# Altium schematic sheet Supply.SchDoc
size A4; SheetNumber: 2; SheetTotal: 8
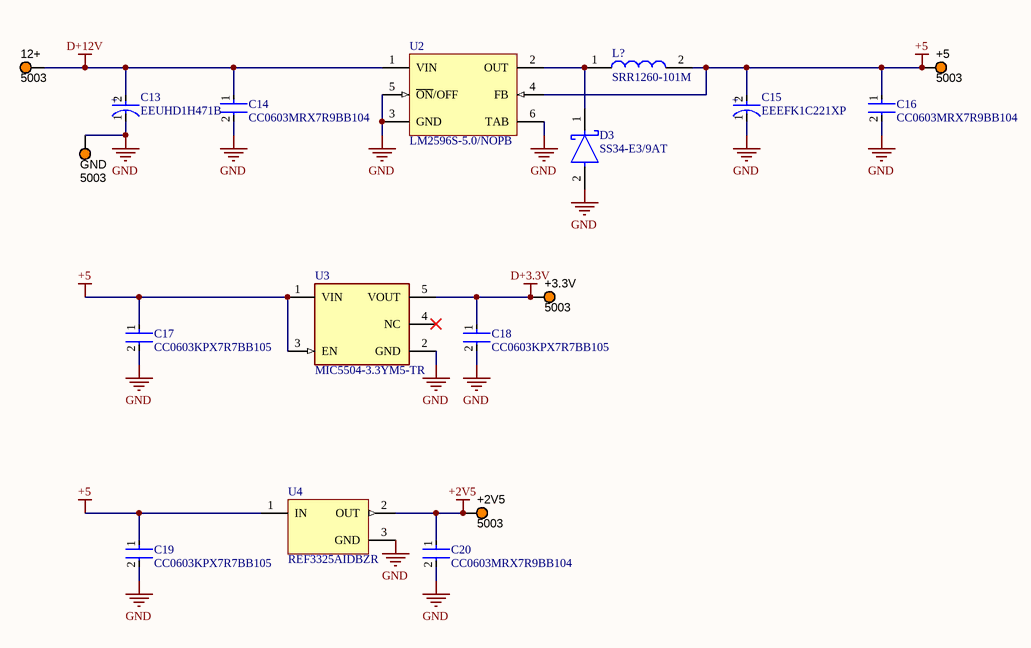
[diagram p0: Supply.SchDoc]

## Parts
12+  5003  [KSTN-5003]
+2V5  5003  [KSTN-5003]
+3.3V  5003  [KSTN-5003]
+5  5003  [KSTN-5003]
C13  EEUHD1H471B  [FP-RAD-TH-D_10_0_5-L_20_2-MFG]
C14  CC0603MRX7R9BB104  [FP-CC0603-DA-MFG]
C15  EEEFK1C221XP  [FP-FKD8-MFG]
C16  CC0603MRX7R9BB104  [FP-CC0603-DA-MFG]
C17  CC0603KPX7R7BB105  [FP-CC0603-DA-MFG]
C18  CC0603KPX7R7BB105  [FP-CC0603-DA-MFG]
C19  CC0603KPX7R7BB105  [FP-CC0603-DA-MFG]
C20  CC0603MRX7R9BB104  [FP-CC0603-DA-MFG]
D3  SS34-E3/9AT  [FP-SMC-MFG]
GND  5003  [KSTN-5003]
L?  SRR1260-101M  [SRR1260101M]
U2  LM2596S-5.0/NOPB  [KTT0005B_M]
U3  MIC5504-3.3YM5-TR  [FP-SOT23-5LD-PL-1-MFG]
U4  REF3325AIDBZR  [DBZ0003A_N]

## Nets
+2V5: +2V5.1 C20.1 U4.2(OUT)
+5: +5.1 C15.2(A) C16.1 C17.1 C19.1 L?.2 U2.4(FB) U3.1(VIN) U3.3(EN) U4.1(IN)
D+3.3V: +3.3V.1 C18.1 U3.5(VOUT)
D+12V: 12+.1 C13.2(A) C14.1 U2.1(VIN)
GND: C13.1(C) C14.2 C15.1(C) C16.2 C17.2 C18.2 C19.2 C20.2 D3.2(A) GND.1 U2.3(GND) U2.5(~{ON}/OFF) U2.6(TAB) U3.2(GND) U4.3(GND)
NetD3_1: D3.1(C) L?.1 U2.2(OUT)

Not connected (* = marked no-connect by the designer): U3 4(NC)*

## Notes on the sheet
- (in symbol CMP-05427-000071-1) +
- (in symbol CMP-05427-002121-1) +

## Library data of the parts
12+ +2V5 +3.3V +5 GND = CMP-002-00037-2: Test Point, Orange, Height 4.6 mm, Tail Length 3 mm, 1-Pin THD, RoHS; Manufacturer: Keystone; Colour: Orange; Packaging: Bulk; Package Description: 1-Pin Through Hole Device, Dia 2.54 mm; Pins: 1; Package Reference: 5003; Datasheet Version: Jun-15; Case/Package: 5003; Mounting Technology: TH; Connector Type: TestPoint; Diameter: 2.54mm; Contact Material: Bronze; Datasheet URL: http://keyelco.com/userAssets/file/M65p56.pdf; Manufacturer URL: http://www.keyelco.com/; Package Quantity: 10; Contact Plating: Tin; RoHS Compliant: True
C13 = CMP-05427-002121-1: Aluminum Electrolytic Capacitors (Radial Lead Type) AEC-Q200 Qualified 470uF ±20% 50V
C14 C16 C20 = CMP-03422-000537-1: CAP CER 0.1UF 50V X7R 0603; Manufacturer: YAGEO; Material: Ceramic; Capacitance: 100 nF; Temperature Coefficient: 15%; Tolerance: 0.2; Value: 100 nF; Temperature Range Low: -55°C; Height: 0.9mm; Temperature Range High: +125°C; Category: Cap; Package: CC0603-DA; Mouser Description: Cap Ceramic 50V 20% +Tol 20% -Tol X7R 15% TC 0.1uF SMD 0603; Temperature Characteristic: X7R; Footprint Url: http://www.yageo.com/exep/pages/download/literatures/UPY-C_GEN_24.pdf; Octopart: https://octopart.com/cc0603mrx7r9bb104-yageo-67308423; RoHS: TRUE; Voltage: 50 V; Manufacturer Part Number: CC0603MRX7R9BB104; Lead Free: Yes; ComponentLink2URL: http://www.yageo.com/documents/recent/UPY-GPHC_X7R_6.3V-to-50V_18.pdf; ComponentLink2Description: Datasheet; Digikey Description: CAP CER 0.1UF 50V X7R 0603; Device Class L2: Capacitors; Automotive: No; Voltage Rating: 50 V; Temperature: -55°C to +125°C; Device Class L1: Passive Components; Device Class L3: Ceramic Capacitors
C15 = CMP-05427-000071-1: CAP ALUM 220UF 20% 16V SMD; Life (Hours): 2000Hour; Ripple Current (AC): 280mA; Leakage Current: 3uA; Polarity: Polar; Material: Aluminium; Impedance: 340mR; Voltage Rating: 16V; Length: 7.7mm; Voltage: 16V; Termination: SMD/SMT; Voltage Rating (DC): 16V; Radiation Hardening: No; Number of Pins: 8; Construction: Cylindrical; Min Operating Temperature: -55°C; Mount: Surface Mount; Series: FK; Height: 7.7mm; REACH SVHC: No SVHC; Tolerance: 20%; Ripple Current: 280mA; Diameter: 6.3mm; RoHS Compliant: Yes; Case/Package: Radial; Height - Seated (Max): 0.315inch; Package Quantity: 900; Packaging: Tape and Reel; Max Operating Temperature: 105°C; Lead Free: Lead Free; Contact Plating: Tin; Width: 8.3mm; Capacitance: 220uF; ESR (Equivalent Series Resistance): 340mR
C17-C19 = CMP-03422-001047-1: CC0603 1 uF X7R 10.00% 16 V; Manufacturer: YAGEO; Temperature Coefficient: 15%; Tolerance: 0.1; Voltage Rating: 16 V; Capacitance: 1 uF; Material: Ceramic; Value: 1 uF; Device Class L3: Ceramic Capacitors; Temperature Characteristic: X7R; Device Class L2: Capacitors; Temperature Range Low: -55°C; Footprint Url: http://www.yageo.com/exep/pages/download/literatures/UPY-C_GEN_24.pdf; Device Class L1: Passive Components; Temperature: -55°C to +125°C; RoHS: TRUE; ComponentLink2URL: http://www.yageo.com/documents/recent/UPY-GPHC_X7R_6.3V-to-50V_18.pdf; Mouser Description: Cap Ceramic 1uF 16V X7R 10% SMD 0603 125°C Paper T/R; Octopart: https://octopart.com/cc0603kpx7r7bb105-yageo-25629533; Automotive: No; Height: 0.9mm; Voltage: 16 V; Lead Free: Yes; Category: Cap; Package: CC0603-DA; Temperature Range High: +125°C; Manufacturer Part Number: CC0603KPX7R7BB105; ComponentLink2Description: Datasheet
D3 = CMP-02539-000066-1: DIODE SCHOTTKY 40V 3A DO214AB; Peak Non-Repetitive Surge Current: 100A; Forward Voltage: 500mV; Element Configuration: Single; Max Reverse Current: 500uA; Case/Package: SMC; Radiation Hardening: No; Series: -; Max Surge Current: 100A; RoHS Compliant: Yes; Min Operating Temperature: -55°C; Average Rectified Current: 3A; Max Reverse Leakage Current: 500uA; Package Quantity: 3500; Max Reverse Voltage (DC): 40V; Forward Current: 3A; Packaging: Tape and Reel; Max Operating Temperature: 125°C; Max Repetitive Reverse Voltage (Vrrm): 40V; Number of Pins: 2; Mount: Surface Mount
L? = SRR1260-101M: Inductor; Manufacturer_Name: Bourns; Datasheet Link: https://componentsearchengine.com/Datasheets/1/SRR1260-101M.pdf; Height: 6.5mm; Manufacturer_Part_Number: SRR1260-101M; Mouser Part Number: 652-SRR1260-101M; Mouser Price/Stock: https://www.mouser.co.uk/ProductDetail/Bourns/SRR1260-101M?qs=uD%2FoUDWqfvQozr%2Ff4%252BPuSQ%3D%3D; Arrow Part Number: SRR1260-101M; Arrow Price/Stock: https://www.arrow.com/en/products/srr1260-101m/bourns?utm_currency=USD&region=nac
U2 = CMP-0069-00269-3: SIMPLE SWITCHER® Power Converter 150 KHz 3A Step-Down Voltage Regulator, 5-pin TO-263, Pb-Free; Manufacturer: Texas Instruments; PowerWise: N; PackageTopMarking: NSUZXYTTE#*LM2596S*-5.0 P+; ComponentLink1URL: http://www.ti.com/general/docs/lit/getliterature.tsp?genericPartNumber=LM2596&fileType=pdf; PackageDescription: TO-263, Molded, .400 x .390 x .180in, 5 Lead, .067in Pitch, Surface Mount; RoHS: Y; PinCount: 5; Code_JEDEC: MO-169-AB; ComponentLink1Description: Datasheet URL; PackageReference: KTT0005B; CompType: Switcher
U3 = CMP-2000-07604-2: IC REG LINEAR 3.3V 300MA SOT23-5; Quiescent Current: 38uA; Operating Supply Current: 42uA; Max Input Voltage: 5.5V; Min Input Voltage: 2.5V; Output Type: Fixed; Power Supply Rejection Ratio (PSRR): 60dB; Dropout Voltage: 380mV; Accuracy: 3%; Number of Outputs: 1; Nominal Output Voltage: 3.3V; Max Output Current: 300mA; Length: 2.9mm; Mount: Surface Mount; Width: 1.6mm; Packaging: Tape and Reel; Output Current: 300mA; Min Operating Temperature: -40°C; Max Operating Temperature: 125°C; Height: 1.1mm; Case/Package: SOT-23-5; REACH SVHC: No SVHC; Number of Pins: 5; Output Voltage: 3.3V
U4 = CMP-0367-00131-2: 30 ppm / degC Drift, 3.9 uA Voltage Reference, -40 to 125 degC, 3-pin SOT-23 (DBZ), Green (RoHS & no Sb/Br); Manufacturer: Texas Instruments; Temp Coeff(Max)(ppm/ degree C): 30; Initial Accuracy @ 25/deg C(%): 0.15; Rating: Catalog; VI(Max)(V): 5.5; Iout/Iz(Max)(mA): 5; VO(V): 2.5; VI(Min)(V): 2.66; SubFamily: Series Voltage Reference; Temp Coeff(Typ)(ppm/ degree C): 8; ComponentLink1Description: Manufacturer URL; PackageReference: DBZ0003A; ComponentLink3Description: Package Specification; PartNumber: REF3325AIDBZR; PackageVersion: 4203227/B; DatasheetVersion: SBOS392A; PackageDescription: 3-Pin Plastic Small Outline, Body 2.92 x 1.3 mm, Pitch 0.95 mm; Eco-Plan: Green (RoHS & no Sb/Br); ComponentLink2Description: Datasheet; ComponentLink3URL: http://www.ti.com/litv/pdf/mpds108a; ComponentLink2URL: http://www.ti.com/general/docs/lit/getliterature.tsp?genericPartNumber=REF3325&fileType=pdf; Iq(Max)(uA): 5; Mounting Technology: Surface Mount; ComponentLink1URL: http://www.ti.com/; Code_JEDEC: TO-236